# EAGLE schematic Experiment5 (EAGLE 8.3.2)
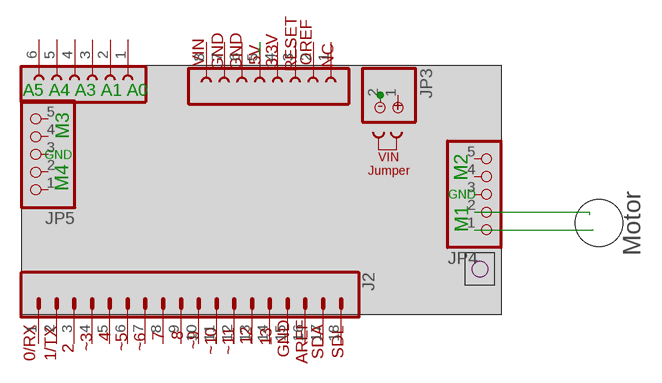
[diagram p0: schematic, sheet 1]

## Parts
ANALOG  FE06-1  [FE06]
J1  JUMPER  [JUMP]
J2  CONN_18  [1X18]
JP3  PINHD-1X2  [1X02]
JP4  PINHD-1X5  [1X05]
JP5  PINHD-1X5  [1X05]
SV2  FE08-1  [FE08]

## Nets
N$1: ANALOG.1
N$2: SV2.5
N$5: JP4.1
N$6: JP4.2
N$7: JP3.2
N$9: JP3.1
Unconnected: ANALOG.2 ANALOG.3 ANALOG.4 ANALOG.5 ANALOG.6 J2.1 J2.2 J2.3 J2.4 J2.5 J2.6 J2.7 J2.8 J2.9 J2.10 J2.11 J2.12 J2.13 J2.14 J2.15 J2.16 J2.17 J2.18 JP4.3 JP4.4 JP4.5 JP5.1 JP5.2 JP5.3 JP5.4 JP5.5 SV2.1 SV2.2 SV2.3 SV2.4 SV2.6 SV2.7 SV2.8

## Notes on the sheet
- RESET | IOREF
- VIN | GND | GND | 5V | 3.3V
- NC
- A5 A4 A3 A1 A0
- - | +
- M3
- GND
- VIN
  Jumper
- M2
- M4 | GND
- Motor
- M1
- 4 | 7 | 8 | 12 | 13 | GND
- 0/RX | 1/TX | ~3 | ~5 | ~6 | ~9 | ~10 | ~11 | AREF | SDA | SDL
- 2

## Library data of the parts
ANALOG = con-lsta:FE06-1: FEMALE HEADER; OC_FARNELL: unknown; OC_NEWARK: unknown
J1 = jumper:JUMPER: JUMPER header
J2 = SparkFun-Connectors:CONN_18: Multi connection point. Often used as Generic Header-pin footprint for 0.1 inch spaced/style header connections On any of the 0.1 inch spaced packages, you can populate with these: Break Away Headers - Straight <https://www.sparkfun.com/products/116> (PRT-00116) Break Away Male Headers - Right Angle <https://www.sparkfun.com/products/553> (PRT-00553) Female Headers <https://www.sparkfun.com/products/115> (PRT-00115) Break Away Headers - Machine Pin <https://www.sparkfun.com/products/117> (PRT-00117) Break Away Female Headers - Swiss Machine Pin <https://www.sparkfun.com/products/743> (PRT-00743) For SCREWTERMINALS and SPRING TERMINALS visit here: Screw Terimnals on SparkFun.com <https://www.sparkfun.com/search/results?term=Screw+Terminals> (5mm/3.5mm/2.54mm spacing) This device is also useful as a general connection point to wire up your design to another part of your project. Our various solder wires solder well into these plated through hole pads. Hook-Up Wire - Assortment (Stranded, 22 AWG) <https://www.sparkfun.com/products/11375> (PRT-11375) Hook-Up Wire - Assortment (Solid Core, 22 AWG) <https://www.sparkfun.com/products/11367> (PRT-11367) View the entire wire category on our website here <https://www.sparkfun.com/categories/141> Special notes: Molex polarized connector foot print use with SKU : PRT-08231 with associated crimp pins and housings. 1MM SMD Version SKU: PRT-10208 NOTES ON THE VARIANTS LOCK and LOCK_LONGPADS... This footprint was designed to help hold the alignment of a through-hole component (i.e. 6-pin header) while soldering it into place. You may notice that each hole has been shifted either up or down by 0.005 of an inch from it's more standard position (which is a perfectly straight line). This slight alteration caused the pins (the squares in the middle) to touch the edges of the holes. Because they are alternating, it causes a "brace" to hold the component in place. 0.005 has proven to be the perfect amount of "off-center" position when using our standard breakaway headers. Although looks a little odd when you look at the bare footprint, once you have a header in there, the alteration is very hard to notice. Also,if you push a header all the way into place, it is covered up entirely on the bottom side.
JP3 = pinhead:PINHD-1X2: PIN HEADER
JP4 JP5 = pinhead:PINHD-1X5: PIN HEADER
SV2 = con-lsta:FE08-1: FEMALE HEADER; OC_FARNELL: unknown; OC_NEWARK: unknown

## Module MOTOR
Ports: 

### Library data of the parts